# Altium project LASET_Prj.PrjPcb
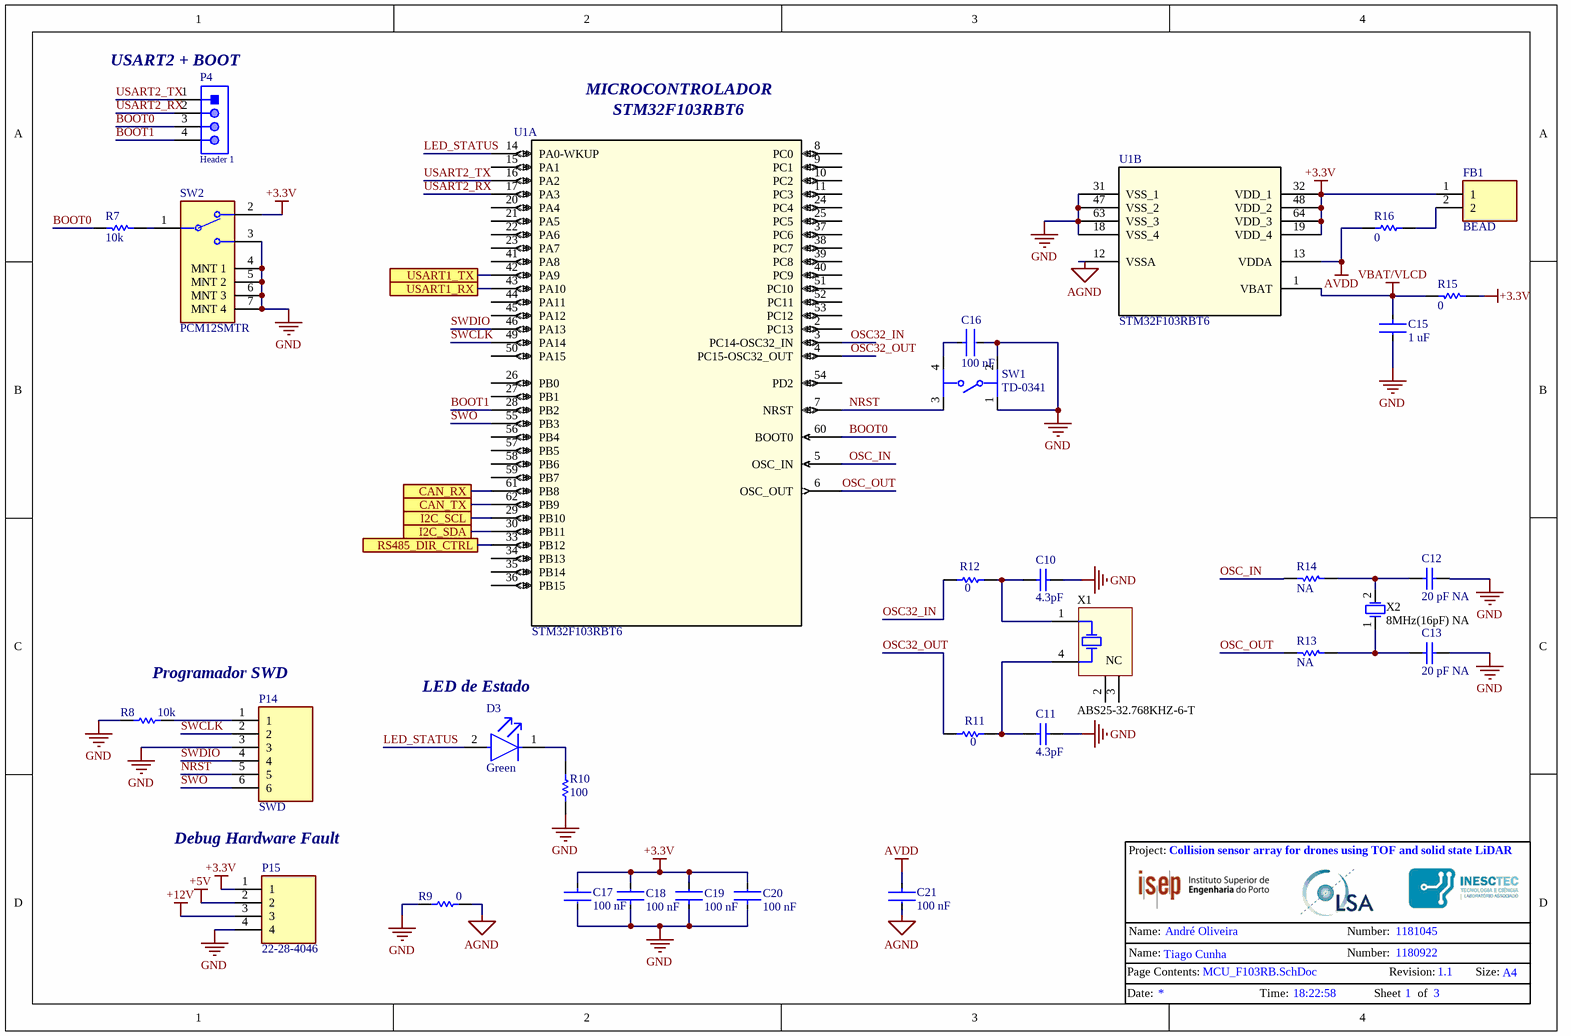
[diagram p0: MCU_F103RB.SchDoc]
Company: Laboratório de Sistemas Autónomos; Name1: André Oliveira; Name2: Tiago Cunha; Number1: 1181045; Number2: 1180922; Project: Collision sensor array for drones using TOF and solid state LiDAR; Size: A4; Time: 18:22:58; VersionRevision: 1.1
3 sheets, 89 parts. Net scope: flat (ports and power ports of the same name join across sheets).
Board file: PCB_Final.PcbDoc
Sheets:
  MCU_F103RB.SchDoc
  Source.SchDoc
  Communication Interfaces.SchDoc

## Sheet MCU_F103RB.SchDoc
size A4; SheetNumber: 1; SheetTotal: 3

### Parts
(Parts that share a designator on the sheet are numbered #1, #2 ... from top to bottom, then left to right.)
?#1  Title_Block  (value not drawn)  (graphical)
C10  4.3pF  [CAPC1608X90X35LL10T15]
C11  4.3pF  [CAPC1608X90X35LL10T15]
C12  20 pF NA  [CAPC1608X90X35NL15T15]
C13  20 pF NA  [CAPC1608X90X35NL15T15]
C15  1 uF  [FP-CC0603-DA-MFG]
C16  100 nF  [FP-CC0603-DA-MFG]
C17  100 nF  [FP-CC0603-DA-MFG]
C18  100 nF  [FP-CC0603-DA-MFG]
C19  100 nF  [FP-CC0603-DA-MFG]
C20  100 nF  [FP-CC0603-DA-MFG]
C21  100 nF  [FP-CC0603-DA-MFG]
D3  Green  [FP-6_541-5056_01-4-MFG]
FB1  BEAD  [BEADC1608X95N]
P4  Header 1  [61300411121]
P14  SWD  [HDRV6W30P0X127_1X6_762X210X430P]
P15  22-28-4046  [HDRV4W66P0X254_1X4_1016X249X838P]
R7  10k  [RESC1608X55X25ML10T15]
R8  10k  [RESC1608X55X25ML10T15]
R9  0  [RESC1608X55X25ML10T15]
R10  100  [RESC1608X55X30ML20T20]
R11  0  [RESC1608X55X25ML10T15]
R12  0  [RESC1608X55X25ML10T15]
R13  NA  [RESC1608X55X25ML10T15]
R14  NA  [RESC1608X55X25ML10T15]
R15  0  [RESC1608X55X25ML10T15]
R16  0  [RESC1608X55X25ML10T15]
SW1  TD-0341  [FP-1571563-9-MFG]
SW2  PCM12SMTR  [FP-PCM12SMTR-MFG]
U1  STM32F103RBT6  [LQFP64-10x10mm]  (parts A,B of 2)
X1  ABS25-32.768KHZ-6-T  [ABRA-ABS25-4_V]
X2  8MHz(16pF) NA  [FOX-FOXSLF160-20]

### Ports
CAN_RX, CAN_TX, I2C_SCL, I2C_SDA, RS485_DIR_CTRL, USART1_RX, USART1_TX

### Nets
+3.3V: C17.1 C18.2 C19.2 C20.2 FB1.1 P15.1 R15.1 SW2.2 U1.19(VDD_4) U1.32(VDD_1) U1.48(VDD_2) U1.64(VDD_3)
+5V: P15.2
+12V: P15.3
AGND: C21.2 R9.2 U1.12(VSSA)
AVDD: C21.1 R16.2 U1.13(VDDA)
GND: C10.2 C11.2 C12.1 C13.1 C15.2 C16.2 C17.2 C18.1 C19.1 C20.1 P14.3 P15.4 R8.1 R9.1 R10.1 SW1.1 SW1.2 SW2.3 SW2.4(MNT_1) SW2.5(MNT_2) SW2.6(MNT_3) SW2.7(MNT_4) U1.18(VSS_4) U1.31(VSS_1) U1.47(VSS_2) U1.63(VSS_3)
VBAT/VLCD: C15.1 R15.2 U1.1(VBAT)
BOOT0: P4.3 R7.2 U1.60(BOOT0)
BOOT1: P4.4 U1.28(PB2)
LED_STATUS: D3.2(A) U1.14(PA0-WKUP)
NRST: P14.5 SW1.3 U1.7(NRST)
OSC32_IN: R12.1 U1.3(PC14-OSC32_IN)
OSC32_OUT: R11.1 U1.4(PC15-OSC32_OUT)
OSC_IN: R14.2 U1.5(OSC_IN)
OSC_OUT: R13.2 U1.6(OSC_OUT)
SWCLK: P14.2 U1.49(PA14)
SWDIO: P14.4 U1.46(PA13)
SWO: P14.6 U1.55(PB3)
USART2_RX: P4.2 U1.17(PA3)
USART2_TX: P4.1 U1.16(PA2)
NetC10_1: C10.1 R12.2 X1.1(X1)
NetC11_1: C11.1 R11.2 X1.4(X2)
NetC12_2: C12.2 R14.1 X2.2
NetC13_2: C13.2 R13.1 X2.1
NetC16_1: C16.1 SW1.4
NetD3_1: D3.1(C) R10.2
NetFB1_2: FB1.2 R16.1
NetP6_2: U1.30(PB11) ; port I2C_SDA
NetP6_3: U1.29(PB10) ; port I2C_SCL
NetP14_1: P14.1 R8.2
NetR7_1: R7.1 SW2.1
NetR19_1: U1.33(PB12) ; port RS485_DIR_CTRL
NetR22_2: U1.42(PA9) ; port USART1_TX
NetR23_2: U1.43(PA10) ; port USART1_RX
NetU1_61: U1.61(PB8) ; port CAN_RX
NetU1_62: U1.62(PB9) ; port CAN_TX

Not connected (* = marked no-connect by the designer): U1 2(PC13) 8(PC0) 9(PC1) 10(PC2) 11(PC3) 15(PA1) 20(PA4) 21(PA5) 22(PA6) 23(PA7) 24(PC4) 25(PC5) 26(PB0) 27(PB1) 34(PB13) 35(PB14) 36(PB15) 37(PC6) 38(PC7) 39(PC8) 40(PC9) 41(PA8) 44(PA11) 45(PA12) 50(PA15) 51(PC10) 52(PC11) 53(PC12) 54(PD2) 56(PB4) 57(PB5) 58(PB6) 59(PB7); X1 2(NC) 3(NC)

### Notes on the sheet
- (near P4) USART2 + BOOT
- MICROCONTROLADOR
- (near U1) STM32F103RBT6
- Programador SWD
- (near D3) LED de Estado
- Debug Hardware Fault
- (in symbol Title_Block) Project:; Name:; Number:; Page Contents:; Revision:; Size:; Date:; Time:; Sheet; of

### Library data of the parts
C10 C11 = CMP-2006-02448-1: 0603; Part Number: GQM1885C2A4R3BB01D; Manufacturer: Murata
C12 C13 = CMP-2006-04264-1: Part Number: 06035A200JAT2A; Manufacturer: AVX Interconnect / Elco
C15 = CMP-1035-02737-2: CAP CER 1UF 16V X5R 0603; Manufacturer Part Number: CC0603KRX5R7BB105; Manufacturer: YAGEO; Material: Ceramic; Temperature Coefficient: 15%; Tolerance: 0.1; Digikey Description: CAP CER 1UF 16V X5R 0603; Category: Cap; Automotive: No; Octopart: https://octopart.com/cc0603krx5r7bb105-yageo-8376530; Voltage Rating: 16 V; Device Class L3: Ceramic Capacitors; Value: 1 uF; Temperature Characteristic: X5R; Voltage: 16 V; RoHS: TRUE; Lead Free: Yes; Temperature: -55°C to +125°C; Device Class L2: Capacitors; ComponentLink2URL: http://www.yageo.com/documents/recent/UPY-GPHC_X7R_6.3V-to-50V_18.pdf; Capacitance: 1 uF; Footprint Url: http://www.yageo.com/exep/pages/download/literatures/UPY-C_GEN_24.pdf; Height: 0.9mm; ComponentLink2Description: Datasheet; Temperature Range High: +125°C; Mouser Description: Multilayer Ceramic Capacitors MLCC - SMD/SMT 1.0uF 16V X5R 10%; Package: CC0603-DA; Device Class L1: Passive Components; Temperature Range Low: -55°C
C16-C21 = CMP-2100-03601-2: CAP CER 0.1UF 50V X7R 0603; Manufacturer: YAGEO; Manufacturer Part Number: CC0603KRX7R9BB104; Material: Ceramic; Temperature Coefficient: 15%; Tolerance: 0.1; Height: 0.9mm; Voltage: 50 V; ComponentLink2Description: Datasheet; Device Class L2: Capacitors; Temperature Range High: +125°C; Category: Cap; Capacitance: 100 nF; Footprint Url: http://www.yageo.com/exep/pages/download/literatures/UPY-C_GEN_24.pdf; ComponentLink2URL: http://www.yageo.com/documents/recent/UPY-GPHC_X7R_6.3V-to-50V_18.pdf; Package: CC0603-DA; Temperature: -55°C to +125°C; Voltage Rating: 50 V; Temperature Characteristic: X7R; Device Class L1: Passive Components; Temperature Range Low: -55°C; RoHS: TRUE; Automotive: No; Value: 100 nF; Device Class L3: Ceramic Capacitors; Octopart: https://octopart.com/cc0603krx7r9bb104-yageo-42244635; Mouser Description: Multilayer Ceramic Capacitor, CC Series, 0.1 - F, - 10%, X7R, 50 V, 0603 [1608 Metric]; Lead Free: Yes; Digikey Description: CAP CER 0.1UF 50V X7R 0603
D3 = CMP-02520-000009-1: LED GREEN 0603 SMD; Manufacturer Part Number: TLMP1100-GS08; Manufacturer: Vishay; Max Junction Temp: +120°C; Automotive Grade: Grade 3; Reverse Voltage: 6V; Led Orientation: Top View; Forward Voltage: 2.1V; Luminous Intensity: 15mcd; Forward Current: 20mA; Colour: Pure green; Peak Emmision Wavelength: 562nm; Wavelength: 561nm; Viewing Angle: 160°; Power Dissipation: 90mW; Digikey Description: LED GREEN 0603 SMD; Package: 6.541-5056.01-4; Ambient Temperature Range High: +100°C; Height: 0.65mm; Device Class L1: Optoelectronics; Device Class L2: LEDs; Mouser Description: Standard LEDs - SMD Pure Green; Temperature Range High: +120°C; RoHS: TRUE; Ambient Temperature Range Low: -40°C; Temperature: to +120°C; ComponentLink2URL: http://www.vishay.com/docs/83173/tlmb1100.pdf; Lead Free: Yes; Octopart: https://octopart.com/tlmp1100-gs08-vishay-55433993; Automotive: Yes; Device Class L3: unset; ComponentLink2Description: Datasheet; Category: Diode
FB1 = MMZ1608S601ATD25: Ferrite Bead; Manufacturer_Name: TDK; Datasheet Link: https://datasheet.datasheetarchive.com/originals/dk/DKDS-25/489214.pdf; Height: 0.95mm; Manufacturer_Part_Number: MMZ1608S601ATD25; Mouser Part Number: 810-MMZ1608S601ATD25; Mouser Price/Stock: https://www.mouser.co.uk/ProductDetail/TDK/MMZ1608S601ATD25?qs=pvNC7ksEVIeMnkuqWHgErw%3D%3D; Arrow Part Number: MMZ1608S601ATD25; Arrow Price/Stock: https://www.arrow.com/en/products/mmz1608s601atd25/tdk
P4 = CMP-1502-01064-1: THT Vertical Pin Header WR-PHD, Pitch 2.54 mm, Single Row, 4 pins; Manufacturer: Wurth Elektronik; Withstanding Voltage: 500VAC; Rated Current: 3A; Working Voltage: 250VAC; Pin Number: 4; Gender: Male; Contact Resistance: 20mOhm; Pitch: 2.54mm; Manufacturer URL: http://www.we-online.de; Operating Temperature: -40to105degC; Packaging: Bag; Mounting Technology: THT; Package Reference: 61300411121; Datasheet URL: https://katalog.we-online.de/em/datasheet/6130xx11121.pdf; Publisher: WurthElektronik; Part Number: 61300411121; Row Number: Single; Orientation: Vertical
P14 = M50-3530642: Connector; Manufacturer_Name: Harwin; Datasheet Link: https://cdn.harwin.com/pdfs/M50-353.pdf; Height: 4.3mm; Manufacturer_Part_Number: M50-3530642; Mouser Part Number: 855-M50-3530642; Mouser Price/Stock: https://www.mouser.co.uk/ProductDetail/Harwin/M50-3530642?qs=%252BdQmOuGyFcHPs2UJx%2F79Cg%3D%3D
P15 = 22-28-4046: Connector; Manufacturer_Name: Molex; Datasheet Link: https://componentsearchengine.com/Datasheets/1/22-28-4046.pdf; Height: 8.38mm; Manufacturer_Part_Number: 22-28-4046; Mouser Part Number: 538-22-28-4046; Mouser Price/Stock: https://www.mouser.co.uk/ProductDetail/Molex/22-28-4046?qs=GAPJcf4kvdtZsXSzVDpHFw%3D%3D
R7 R8 = CMP-2000-05022-1: Resistor, 10 kOhm, +/- 5%, 100 mW, -55 to 155 degC, 0603 (1608 Metric), RoHS, Tape and Reel; Manufacturer: Yageo; Resistance: 10kOhms; Voltage Rating: 50V; Temperature Coefficient: 100PPM/C; Power Rating: 100mW; Package Reference: 603; Series: RC; Case Code - mm: 1608; Packaging: Reel; Datasheet URL: http://www.farnell.com/datasheets/443971.pdf; Datasheet Version: Rev. 4, 04/2009; Operating Temperature Range: -55Cto+155C; Product: ThickFilmResistorsGeneralPurpose; Package Description: 2-Pin Surface Mount Device, Body 1.6 x 0.8 mm; Manufacturer URL: http://www.yageo.com/; Case Code - in: 0603; Tolerance: 5%; Termination Style: SMD/SMT
R9 R11-R16 = CMP-2100-03667-1: Chip Resistor, 0 Ohm, +/- 5%, 0.1 W, -55 to 155 degC, 0603 (1608 Metric), RoHS, Tape and Reel; Manufacturer: Yageo; Temperature Coefficient: 200ppm/degreesC; Voltage Rating: 50V; Power Rating: 100mW; Resistance: 0mOhm; Width: 0.8mm; Max Operating Temperature: 155degC; Tolerance: 5%; Package Reference: 0603; Height: 0.45mm; Depth: 0.8mm; Package Description: 2-Pin Surface Mount Device, Body 1.6 x 0.8 mm; Termination: SMD/SMT; Package Quantity: 5000; Case/Package: 0603; Case Code (Imperial): 0603; Radiation Hardening: No; Number of Pins: 2; Length: 1.6mm; Lead Free: LeadFree; Voltage Rating (DC): 50V; Military Standard: Not; Datasheet URL: http://www.yageo.com/NewPortal/yageodocoutput?fileName=/pdf/R-Chip/PYu-RC_Group_51_RoHS_L_5.pdf; Manufacturer URL: http://www.yageo.com/; Packaging: TapeandReel; Case Code (Metric): 1608; Min Operating Temperature: -55degC; Composition: ThickFilm; RoHSCompliant: true; Contact Plating: Tin; Datasheet Version: Rev. 5, 10/2016; REACH SVHC: NoSVHC
R10 = CMP-2000-00897-1: Manufacturer: Panasonic; Part Number: ERA3AEB122V
SW1 = CMP-03402-000005-1: SWITCH TACTILE SPST-NO 0.05A 24V; Manufacturer: TE Connectivity; Manufacturer Part Number: 1571563-9; Standoff Height: 0.05mm; Electromechanical Life: 100000Cycles; Contact Resistance: 100mΩ; Operating Force: 160gf; Contact Current Rating: 50mA; Automotive: No; Device Class L1: Electromechanical; Voltage Rating Dc: 24V; ComponentLink2Description: Datasheet; Mount: Surface Mount; RoHS: TRUE; Temperature: -35°C to +85°C; ComponentLink2URL: https://www.te.com/commerce/DocumentDelivery/DDEController?Action=showdoc&DocId=Customer+Drawing%7F2-1437565-7%7FV%7Fpdf%7FEnglish%7FENG_CD_2-1437565-7_V.pdf%7F1571563-9; Temperature Range Low: -35°C; Lead Free: Yes; Device Class L2: Switches; Package: SMT_SW_6MM0_6MM0; Octopart: https://octopart.com/1571563-9-te+connectivity-41253969; Throw Configuration: SPST-NO; Mouser Description: Tactile Switches SPST OFF(ON) RND SMT MINI PB TACT SWITCH; Temperature Range High: +85°C; Digikey Description: SWITCH TACTILE SPST-NO 0.05A 24V; Device Class L3: Pushbutton Switches; Category: Switch; Height: 9.75mm
SW2 = CMP-2000-06884-2: SWITCH SLIDE SPDT 300MA 6V; Actuator Material: Nylon; Switch Function: On-On; Insulation Resistance: 100mR; Actuator Type: Standard; Mechanical Life: 10000Cycles; Actuator Length: 1.5mm; Contact Resistance: 70mR; Min Operating Temperature: -20°C; Max Current Rating: 300mA; Max Voltage Rating (DC): 6V; Package Quantity: 1; Mount: Surface Mount; Packaging: Tape and Reel; Contact Plating: Silver; Depth: 5mm; REACH SVHC: No SVHC; Voltage Rating (DC): 6V; Voltage Rating (AC): 6V; Max Operating Temperature: 85°C; Length: 7.7mm; Termination: Gull Wing; Current Rating: 300mA; Contact Current Rating: 300mA; Orientation: Right Angle; Width: 6.7mm; Switch Travel: 1.5mm; Lead Free: Lead Free; Contact Material: Copper Alloy; Throw Configuration: SPDT
U1 = STM32F103RBT6: No Description Available; Mfr_Name: STMicroelectronics; Copyright: Copyright (C) 2021 Ultra Librarian. All rights reserved.; Manufacturer_Part_Number: STM32F103RBT6; RefDes: RefDes; Type: DEV
X1 = CMP-2000-05036-1: Low Frequency Crystal, 32.768 KHz, 6 pF, +/- 20 ppm, -40 to 85 degC, 4-Pin SMD, RoHS, Tape and Reel; Manufacturer: Abracon; Tolerance: 20PPM; ESR: 50kOhms; Case Width: 3.8mm; Case Height: 2.5mm; Case Length: 8mm; Load Capacitance: 6pF; Operating Temperature Range: -40Cto+85C; Package Reference: ABS25; Factory Pack Quantity: 3000; Package Description: 4-Pin Surface Mount Device, Body 8 x 3.8 mm, Pitch 5.5 mm; Frequency: 32.768kHz; Termination Style: SMD/SMT; Manufacturer URL: http://www.abracon.com/; Type: LowFrequencyCrystal; Dimensions: 3.8mmWx8mmLx2.5mmH; Product Category: Crystals; Series: ABS25; RoHS: Details; Package / Case: 8mmx3.8mm; Datasheet Version: Jun-17; Brand: ABRACON; Datasheet URL: https://datasheet.ciiva.com/854/abs25-854528.pdf; Packaging: Reel; Mounting Style: SMD/SMT
X2 = CMP-1749-00003-1: Resistance Weld Thru-Hole Crystal, 16 MHz, -20 to 70 degC, 2-Pin THD, RoHS, Bulk; Voltage Rating: 250 V; Tolerance: 1%; Resistance: 221 kohm; Case\Package: Axial; Power Rating: 250 mW; RoHSCompliant: true; Package Quantity: 200; Packaging: Bulk; Min Operating Temperature: -55 degC; DatasheetVersion: Mar-15; ComponentLink1URL: http://www.foxonline.com/; Max Operating Temperature: 155 degC; PackageReference: FOXSLF160-20; Mount: Through Hole; PackageDescription: 2-Pin Through Hole Device, Body 11.35 x 4.65 mm; ComponentLink1Description: Manufacturer URL; ComponentLink2URL: http://www.foxonline.com/pdfs/hc49slf.pdf; ComponentLink2Description: Datasheet; Length: 0.248 inch

## Sheet Source.SchDoc
size A4; SheetNumber: 2; SheetTotal: 3
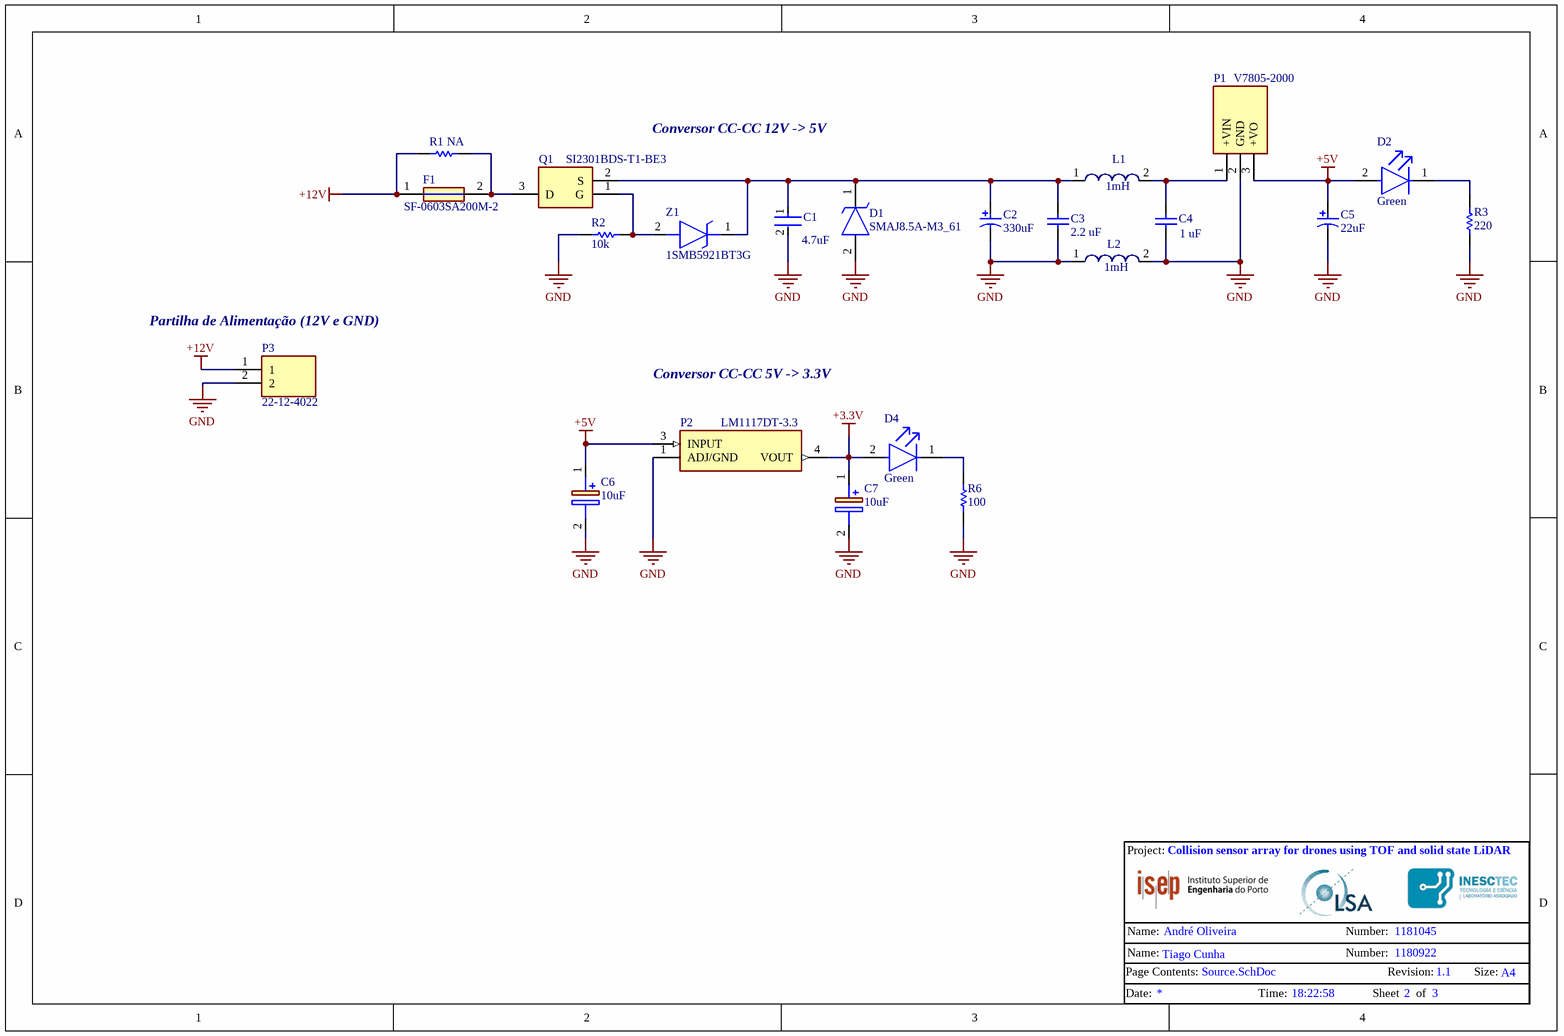
[diagram p1: Source.SchDoc]

### Parts
(Parts that share a designator on the sheet are numbered #1, #2 ... from top to bottom, then left to right.)
?#2  Title_Block  (value not drawn)  (graphical)
C1  4.7uF  [FP-C0603-CG-MFG]
C2  330uF  [NIC-CAPA2-8X10_V]
C3  2.2 uF  [CAPC2013X152X50ML20T25]
C4  1 uF  [CAPC3216X180X50ML20T25]
C5  22uF  [AVX-TAJ-B-2_M]
C6  10uF  [CAPPM3216X180N]
C7  10uF  [CAPPM3216X180N]
D1  SMAJ8.5A-M3_61  [DIOM5127X229N]
D2  Green  [FP-6_541-5056_01-4-MFG]
D4  Green  [FP-6_541-5056_01-4-MFG]
F1  SF-0603SA200M-2  [FUSC1608X95N]
L1  1mH  [1060]
L2  1mH  [1060]
P1  V7805-2000  [V78052000]
P2  LM1117DT-3.3  [TO228P991X238-3N]
P3  22-12-4022  [SHDRRA2W64P0X254_1X2_508X1170X580P]
Q1  SI2301BDS-T1-BE3  [SOT95P237X112-3N]
R1  NA  [RESC1608X55X30ML20T20]
R2  10k  [RESC1608X55X30ML20T20]
R3  220  [RESC1608X55X30ML20T20]
R6  100  [RESC1608X55X30ML20T20]
Z1  1SMB5921BT3G  [DIOM5436X247N]

### Nets
+3.3V: C7.1(+) D4.2(A) P2.4(VOUT)
+5V: C5.1 C6.1(+) D2.2(A) P1.3(+VO) P2.3(INPUT)
+12V: F1.1 P3.1 R1.2
GND: C1.2 C2.2 C3.1 C4.1 C5.2 C6.2(-) C7.2(-) D1.2(A) L2.1 L2.2 P1.2(GND) P2.1(ADJ/GND) P3.2 R2.2 R3.1 R6.1
NetC1_1: C1.1 C2.1 C3.2 D1.1(K) L1.1 Q1.2(S) Z1.1(K)
NetC4_2: C4.2 L1.2 P1.1(+VIN)
NetD2_1: D2.1(C) R3.2
NetD4_1: D4.1(C) R6.2
NetF1_2: F1.2 Q1.3(D) R1.1
NetQ1_1: Q1.1(G) R2.1 Z1.2(A)

### Notes on the sheet
- Conversor CC-CC 12V -> 5V
- (near P3) Partilha de Alimentação (12V e GND)
- Conversor CC-CC 5V -> 3.3V
- (in symbol Title_Block) Project:; Name:; Number:; Page Contents:; Revision:; Size:; Date:; Time:; Sheet; of

### Library data of the parts
C1 = CMP-2006-02256-2: CAP CER 4.7UF 6.3V X5R 0603; Manufacturer: Kemet; Manufacturer Part Number: C0603C475K9PACTU; Temperature Coefficient: 15%; Tolerance: 10%; Material: Ceramic; Device Class L3: Ceramic Capacitors; RoHS: TRUE; Value: 4.7uF; Lead Free: Yes; ComponentLink2Description: Datasheet; Mouser Description: Multilayer Ceramic Capacitors MLCC - SMD/SMT 6.3volts 4.7uF X5R 10%; Package: C0603-CG; Digikey Description: CAP CER 4.7UF 6.3V X5R 0603; ComponentLink2URL: https://content.kemet.com/datasheets/KEM_C1006_X5R_SMD.pdf; Category: Cap; Temperature Range Low: -55°C; Capacitance: 4.7uF; Temperature: -55°C to +85°C; Octopart: https://octopart.com/c0603c475k9pactu-kemet-104242; Ipc Land Pattern Name: CAPC16080X80; Voltage Rating: 6.3V; Temperature Range High: +85°C; Height: 0.9mm; Temperature Characteristic: X5R; Device Class L1: Passive Components; Automotive: No; Device Class L2: Capacitors
C2 = CMP-0687-00068-1: Aluminum Electrolytic Capacitor, UD Series, Low Impedance, 330 uF, 25 V, + / - 20%, -55 to 105 degC, Chip Type, 8 x 10 mm D x L, Pb-Free, Reel; PartNumber: UUD1E331MNL1GS; Manufacturer: Nichicon; Rated Voltage: 25 V; Tolerance Rated Capacitance: -20 to 20%; Packing: Dia382mm Reel; Impedance: 0.17 Ohm; Rated Ripple Current (at 100kHz): 450 mA; Endurance Time: 5000 h; ComponentLink3URL: http://products.nichicon.co.jp/en/pdf/XJA043/e-ud.pdf; PackageDescription: 2-Pin Surface Mount Device, Diameter 8 mm, Height 10 mm, Pitch 6.5 mm; ComponentLink1URL: http://www.nichicon.co.jp/; PackageReference: CAPAE-D8H10; ComponentLink1Description: Manufacturer URL; ComponentLink2Description: Datasheet; DatasheetVersion: 08/2012; RoHS: TRUE; Diameter: 8 mm; Mounting Technology: Surface Mount; ComponentLink2URL: http://products.nichicon.co.jp/en/pdf/XJA043/e-ud.pdf; ComponentLink3Description: Package Specification; Rated Capacitance: 330 uF; Length: 10 mm
C3 = CMP-2007-04514-1: Part Number: 08053C225KAT2A; Manufacturer: AVX Interconnect / Elco
C4 = CMP-2000-04991-1: Chip Capacitor, 1 uF, +/- 10%, 25 V, -55 to 125 degC, 1206 (3216 Metric), RoHS, Tape and Reel; Manufacturer: Kemet; Temperature Coefficient / Code: +/-15%; Capacitance: 1uF; Dielectric: X7R; Voltage Rating DC: 25V; Capacitance - nF: 1000nF; Class: Class1; Case Length: 3.2mm; Type: SMDMLCCX7R6.3-250VDCCommericalGrade; Case Width: 1.6mm; Product: GeneralTypeMLCCs; Datasheet URL: https://ciiva.com/datasheet-click-18194173?src=ciiva&sig=6daff8c4; Operating Temperature Range: -55Cto+125C; Series: C1206C; RoHS: Details; Product Category: MultilayerCeramicCapacitorsMLCC-SMD/SMT; Manufacturer URL: http://www.kemet.com/; Minimum Operating Temperature: -55C; Dimensions: 1.6mmWx3.2mmLx1.6mmH; Termination Style: SMD/SMT; Brand: Kemet; Packaging: Reel; Package / Case: 1206(3216metric); Case Code - mm: 3216; Datasheet Version: Jul-14; Factory Pack Quantity: 2000; Package Description: 2-Pin Surface Mount Device, Body 3.2 x 1.6 mm; Tolerance: 10%; Package Reference: 1206; Case Height: 1.6mm; Case Code - in: 1206; Maximum Operating Temperature: +125C; Voltage Rating: 25V
C5 = CMP-2100-03689-1: Standard Tantalum, 22 uF, +/- 10%, 16 V, -55 to 125 degC, 2-Pin SMD (1210), RoHS, Tape and Reel; Manufacturer: AVX; Leakage Current: 3.5uA; Dissipation Factor: 6%; Voltage Rating (DC): 16V; ESR (Equivalent Series Resistance): 2.3Ohm; Polarity: Polar; Package Quantity: 1; Tolerance: 10%; Number of Pins: 2; Manufacturer URL: http://www.avx.com/; Height - Seated (Max): 0.083inch; Case Code (Imperial): 1210; Package Reference: TAJ-B-2; Height: 1.9mm; Depth: 2.8mm; Packaging: TapeandReel; Termination: SMD/SMT; Case/Package: 1210; Lead Free: LeadFree; Min Operating Temperature: -55degC; Capacitance: 22uF; RoHSCompliant: True; Dielectric Material: Tantalum; Case Code (Metric): 3528; Width: 2.8mm; Datasheet URL: http://datasheets.avx.com/TAJ.pdf; Radiation Hardening: No; Package Description: 2-Pin Surface Mount Device, Body 3.5 x 2.85 mm; Length: 3.5mm; Voltage Rating: 16V; Datasheet Version: 42401.0; Max Operating Temperature: 125degC; REACH SVHC: NoSVHC; Voltage: 16V
C6 C7 = T491A106K020AT: Capacitor Polarised; Manufacturer_Name: Kemet; Datasheet Link: https://4donline.ihs.com/images/VipMasterIC/IC/KEME/KEME-S-A0006487387/KEME-S-A0006487387-1.pdf?hkey=52A5661711E402568146F3353EA87419; Height: 1.8mm; Manufacturer_Part_Number: T491A106K020AT; Mouser Part Number: 80-T491A106K020AT; Mouser Price/Stock: https://www.mouser.co.uk/ProductDetail/KEMET/T491A106K020AT?qs=TooEEMgOWu79qKWrUr4%2FRg%3D%3D; Arrow Part Number: T491A106K020AT; Arrow Price/Stock: https://www.arrow.com/en/products/t491a106k020at/kemet-corporation
D1 = SMAJ8.5A-M3_61: TVS Diode (Uni-directional); Manufacturer_Name: Vishay; Manufacturer_Part_Number: SMAJ8.5A-M3/61; Datasheet Link: http://www.alldatasheet.com/view.jsp?Searchword=SMAJ8.5A-M3/61; Height: 2.29mm
D2 D4 = CMP-02520-000009-1: as D3 on sheet MCU_F103RB; Digikey Description: LED GREEN 0603 SMD; Package: 6.541-5056.01-4; Ambient Temperature Range High: +100°C; Height: 0.65mm; Device Class L1: Optoelectronics; Device Class L2: LEDs; Mouser Description: Standard LEDs - SMD Pure Green; Temperature Range High: +120°C; RoHS: TRUE; Ambient Temperature Range Low: -40°C; Temperature: to +120°C; ComponentLink2URL: http://www.vishay.com/docs/83173/tlmb1100.pdf; Lead Free: Yes; Octopart: https://octopart.com/tlmp1100-gs08-vishay-55433993; Automotive: Yes; Device Class L3: unset; ComponentLink2Description: Datasheet; Category: Diode
F1 = SF-0603SA200M-2: Fuse; Manufacturer_Name: Bourns; Datasheet Link: https://www.bourns.com/docs/product-datasheets/sf-0603sa-m.pdf?sfvrsn=b5654bf6_7; Height: 0.95mm; Manufacturer_Part_Number: SF-0603SA200M-2; Mouser Part Number: 652-SF-0603SA200M-2; Mouser Price/Stock: https://www.mouser.co.uk/ProductDetail/Bourns/SF-0603SA200M-2?qs=ljCeji4nMDnUko368dFg%2Fg%3D%3D
L1 L2 = CMP-1387-00004-1: SMD Power Inductor WE-PD HV, L=1000 µH; Manufacturer: Wuerth Elektronik; PartNumber: 7687714102; Inductance: 1000 ÂµH; ComponentLink1Description: Manufacturer URL; ComponentLink2Description: Datasheet; PackageReference: 1060; ComponentLink2URL: http://www.we-online.de/katalog/media/pdf/7687714102.pdf; ComponentLink1URL: http://www.we-online.com
P1 = V7805-2000: Power Supply; Manufacturer_Name: CUI Inc.; Datasheet Link: https://componentsearchengine.com/Datasheets/1/V7805-2000.pdf; Height: 17.5mm; Manufacturer_Part_Number: V7805-2000; Mouser Part Number: 490-V7805-2000; Mouser Price/Stock: https://www.mouser.co.uk/ProductDetail/CUI-Inc/V7805-2000?qs=WyjlAZoYn5278Y2RvahTNg%3D%3D; Arrow Part Number: V7805-2000; Arrow Price/Stock: https://www.arrow.com/en/products/v7805-2000/cui-inc?region=nac
P2 = LM1117DT-3.3_NOPB: Integrated Circuit; Manufacturer_Name: Texas Instruments; Manufacturer_Part_Number: LM1117DT-3.3/NOPB; Datasheet Link: https://datasheet.datasheetarchive.com/originals/distributors/Datasheets-SFU2/DSASFU100036103.pdf; Height: 2.38mm; Mouser Part Number: 926-LM1117DT-3.3NOPB; Mouser Price/Stock: https://www.mouser.co.uk/ProductDetail/Texas-Instruments/LM1117DT-33-NOPB?qs=X1J7HmVL2ZHOT670myqy2w%3D%3D; Arrow Part Number: LM1117DT-3.3/NOPB; Arrow Price/Stock: https://www.arrow.com/en/products/lm1117dt-3.3nopb/texas-instruments
P3 = 22-12-4022: Connector; Manufacturer_Name: Molex; Datasheet Link: https://www.molex.com/pdm_docs/sd/022124022_sd.pdf; Height: 5.8mm; Manufacturer_Part_Number: 22-12-4022; Mouser Part Number: 538-22-12-4022; Mouser Price/Stock: https://www.mouser.co.uk/ProductDetail/Molex/22-12-4022?qs=SdQWveS8jHPGKP%2Fe4QVy2w%3D%3D
Q1 = SI2301BDS-T1-BE3: Integrated Circuit; Manufacturer_Name: Vishay; Datasheet Link: https://www.arrow.com/en/products/si2301bds-t1-be3/vishay?region=nac; Height: 1.12mm; Manufacturer_Part_Number: SI2301BDS-T1-BE3; Mouser Part Number: 78-SI2301BDS-T1-BE3; Mouser Price/Stock: https://www.mouser.co.uk/ProductDetail/Vishay-Siliconix/SI2301BDS-T1-BE3?qs=CiayqK2gdcLKGqyOqDFpxQ%3D%3D; Arrow Part Number: SI2301BDS-T1-BE3; Arrow Price/Stock: https://www.arrow.com/en/products/si2301bds-t1-be3/vishay?region=nac
R1-R3 R6 = CMP-2000-00897-1: as R10 on sheet MCU_F103RB
Z1 = 1SMB5921BT3G: Zener Diode; Manufacturer_Name: ON Semiconductor; Datasheet Link: http://www.onsemi.com/pub/Collateral/1SMB5913BT3-D.PDF; Height: 2.47mm; Manufacturer_Part_Number: 1SMB5921BT3G; Mouser Part Number: 863-1SMB5921BT3G; Mouser Price/Stock: https://www.mouser.co.uk/ProductDetail/ON-Semiconductor/1SMB5921BT3G?qs=vLkC5FC1VN%2FJmQCOkKzbLQ%3D%3D; Arrow Part Number: 1SMB5921BT3G; Arrow Price/Stock: https://www.arrow.com/en/products/1smb5921bt3g/on-semiconductor

## Sheet Communication Interfaces.SchDoc
size A4; SheetNumber: 3; SheetTotal: 3
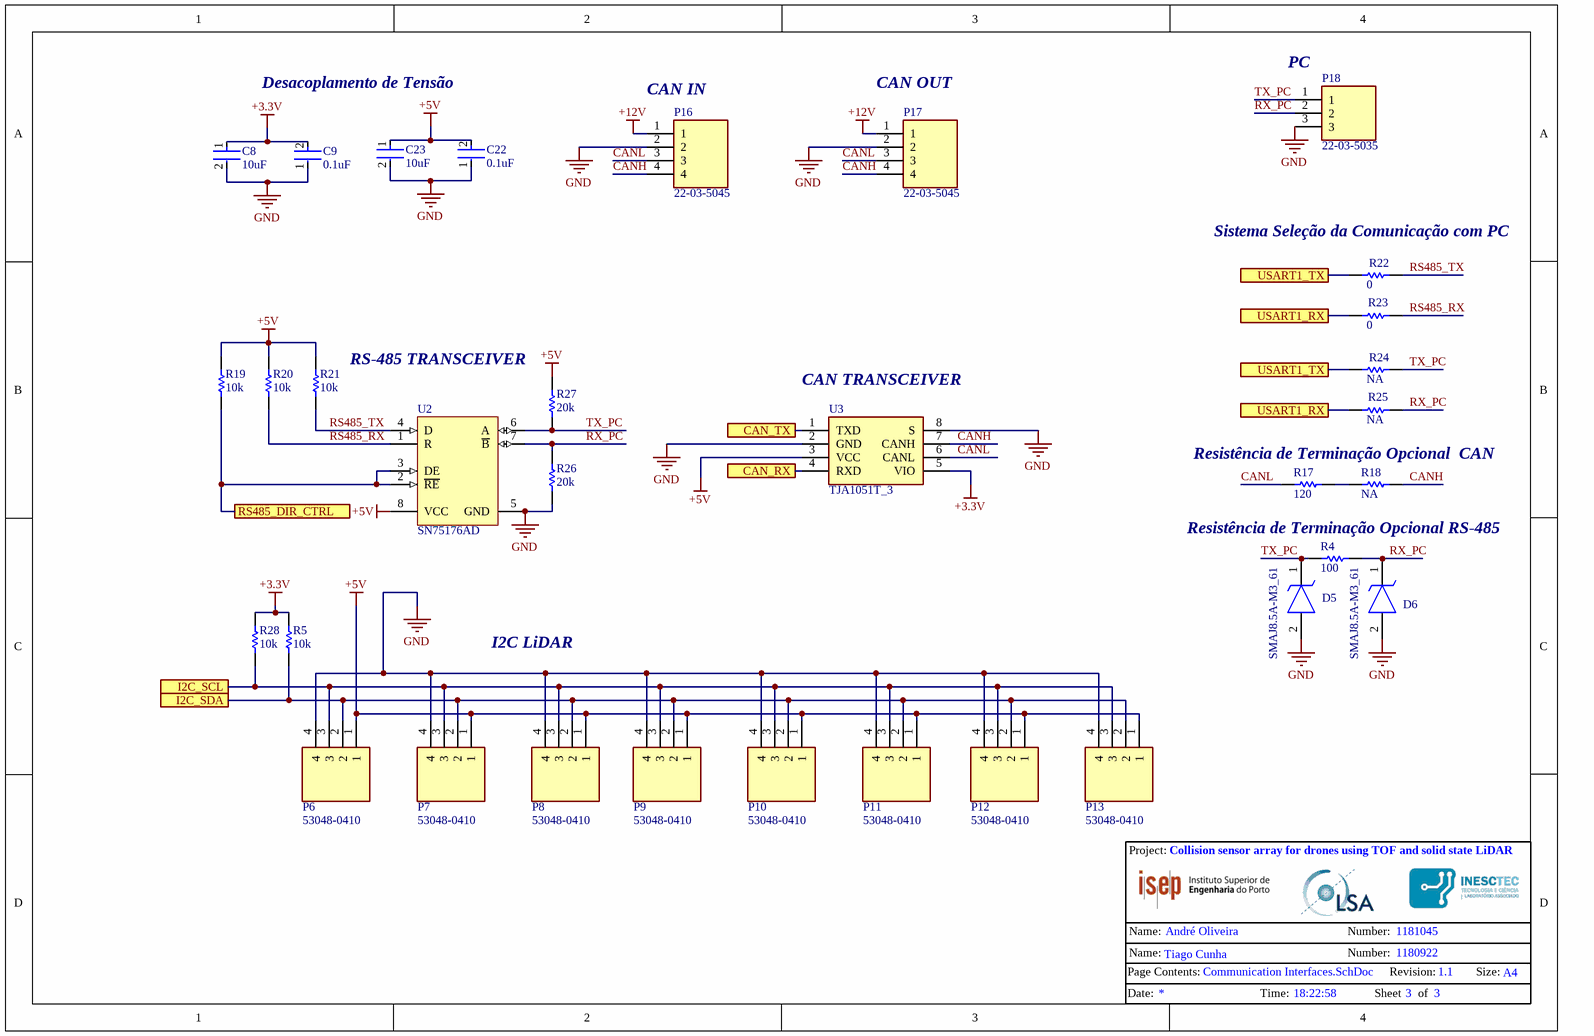
[diagram p2: Communication Interfaces.SchDoc]

### Parts
(Parts that share a designator on the sheet are numbered #1, #2 ... from top to bottom, then left to right.)
?#3  Title_Block  (value not drawn)  (graphical)
C8  10uF  [FP-C3216-160-0_2-IPC_C]
C9  0.1uF  [FP-GRM15-MFG]
C22  0.1uF  [FP-GRM15-MFG]
C23  10uF  [FP-C3216-160-0_2-IPC_C]
D5  SMAJ8.5A-M3_61  [DIOM5127X229N]
D6  SMAJ8.5A-M3_61  [DIOM5127X229N]
P6  53048-0410  [530480410]
P7  53048-0410  [530480410]
P8  53048-0410  [530480410]
P9  53048-0410  [530480410]
P10  53048-0410  [530480410]
P11  53048-0410  [530480410]
P12  53048-0410  [530480410]
P13  53048-0410  [530480410]
P16  22-03-5045  [SHDR4W70P0X250_1X4_1240X490X610P]
P17  22-03-5045  [SHDR4W70P0X250_1X4_1240X490X610P]
P18  22-03-5035  [SHDR3W60P0X250_1X3_990X490X590P]
R4  100  [RESC1608X55X30ML20T20]
R5  10k  [RESC1608X55X30ML20T20]
R17  120  [RESC1608X55X30ML20T20]
R18  NA  [RESC1608X55X30ML20T20]
R19  10k  [RESC1608X55X30ML20T20]
R20  10k  [RESC1608X55X30ML20T20]
R21  10k  [RESC1608X55X30ML20T20]
R22  0  [RESC1608X55X30ML20T20]
R23  0  [RESC1608X55X30ML20T20]
R24  NA  [RESC1608X55X30ML20T20]
R25  NA  [RESC1608X55X30ML20T20]
R26  20k  [RESC1608X55X30ML20T20]
R27  20k  [RESC1608X55X30ML20T20]
R28  10k  [RESC1608X55X30ML20T20]
U2  SN75176AD  [D0008A_M]
U3  TJA1051T_3  [SOIC127P600X175-8N]

### Ports
CAN_RX, CAN_TX, I2C_SCL, I2C_SDA, RS485_DIR_CTRL, USART1_RX, USART1_TX

### Nets
+3.3V: C8.1 C9.2 R5.2 R28.2 U3.5(VIO)
+5V: C22.2 C23.1 P6.1 P7.1 P8.1 P9.1 P10.1 P11.1 P12.1 P13.1 R19.2 R20.2 R21.2 R27.1 U2.8(VCC) U3.3(VCC)
+12V: P16.1 P17.1
GND: C8.2 C9.1 C22.1 C23.2 D5.2(A) D6.2(A) P6.4 P7.4 P8.4 P9.4 P10.4 P11.4 P12.4 P13.4 P16.2 P17.2 P18.3 R26.2 U2.5(GND) U3.2(GND) U3.8(S)
CANH: P16.4 P17.4 R18.1 U3.7(CANH)
CANL: P16.3 P17.3 R17.2 U3.6(CANL)
RS485_RX: R20.1 R23.1 U2.1(R)
RS485_TX: R21.1 R22.1 U2.4(D)
RX_PC: D6.1(K) P18.2 R4.1 R25.1 R26.1 U2.7(~{B})
TX_PC: D5.1(K) P18.1 R4.2 R24.1 R27.2 U2.6(A)
NetP6_2: P6.2 P7.2 P8.2 P9.2 P10.2 P11.2 P12.2 P13.2 R5.1 ; port I2C_SDA
NetP6_3: P6.3 P7.3 P8.3 P9.3 P10.3 P11.3 P12.3 P13.3 R28.1 ; port I2C_SCL
NetR17_1: R17.1 R18.2
NetR19_1: R19.1 U2.2(~{RE}) U2.3(DE) ; port RS485_DIR_CTRL
NetR22_2: R22.2 R24.2 ; port USART1_TX
NetR23_2: R23.2 R25.2 ; port USART1_RX
NetU1_61: U3.4(RXD) ; port CAN_RX
NetU1_62: U3.1(TXD) ; port CAN_TX

### Notes on the sheet
- Desacoplamento de Tensão
- (near P16) CAN IN
- (near P17) CAN OUT
- (near P18) PC
- (near R22) Sistema Seleção da Comunicação com PC
- RS-485 TRANSCEIVER
- (near U3) CAN TRANSCEIVER
- Resistência de Terminação Opcional  CAN
- (near R4) Resistência de Terminação Opcional RS-485
- I2C LiDAR
- (in symbol Title_Block) Project:; Name:; Number:; Page Contents:; Revision:; Size:; Date:; Time:; Sheet; of

### Library data of the parts
C8 C23 = CMP-08246-003443-1: Multilayer Ceramic Capacitors 10uF ±10% 16V X5R SMD 1206; Packaging: Tape and Reel; Thickness: 0.071inch; REACH SVHC: No SVHC; Lead Free: Lead Free; Voltage: 16V; Case Code (Imperial): 1206; RoHS Compliant: Yes; Dielectric Material: Ceramic; Termination: SMD/SMT; Resistor Type: Ceramic; Dielectric: X5R; Width: 0.063inch; Construction: Flat; Length: 3.2mm; Voltage Rating (DC): 16V; Case/Package: 1206; Series: C; Package Quantity: 1; Weight: 0.000571oz; Height: 1.6mm; Voltage Rating: 16V; Tolerance: 10%; Case Code (Metric): 3216; Max Operating Temperature: 85°C; Mount: Surface Mount; Min Operating Temperature: -55°C; Depth: 1.6mm; Radiation Hardening: No; Capacitance: 10uF
C9 C22 = CMP-2100-03641-2: CAP CER 0.1UF 16V X7R 0402; Manufacturer Part Number: GRM155R71C104KA88D; Manufacturer: Murata; Standoff Height: 0mm; Tolerance: 10%; Voltage Rating: 16Vdc; Material: Ceramic; Capacitance: 0.10μF; Value: 0.10μF; RoHS: TRUE; Temperature Characteristic: X7R; Octopart: https://octopart.com/grm155r71c104ka88d-murata-196880; Digikey Description: CAP CER 0.1UF 16V X7R 0402; Device Class L3: Ceramic Capacitors; Height: 0.55mm; ComponentLink2Description: Datasheet; Temperature Range Low: -55°C; Ipc Land Pattern Name: CAPC10050X219; ComponentLink2URL: https://search.murata.co.jp/Ceramy/image/img/A01X/G101/ENG/GRM155R71H471KA01-01A.pdf; Device Class L1: Passive Components; Lead Free: yes; Category: Cap; Package: GRM15; Temperature: -55°C to +125°C; Device Class L2: Capacitors; Temperature Range High: +125°C; Mouser Description: 0402 0.1 uF 16V ±10 % Tolerance X7R SMT Multilayer Ceramic Capacitor
D5 D6 = SMAJ8.5A-M3_61: as D1 on sheet Source; Datasheet Link: http://www.alldatasheet.com/view.jsp?Searchword=SMAJ8.5A-M3/61; Height: 2.29mm
P6-P13 = 53048-0410: Connector; Manufacturer_Name: Molex; Datasheet Link: https://www.molex.com/pdm_docs/sd/530480410_sd.pdf; Height: 3.7mm; Manufacturer_Part_Number: 53048-0410; Mouser Part Number: 538-53048-0410; Mouser Price/Stock: https://www.mouser.co.uk/ProductDetail/Molex/53048-0410?qs=359VwiUTsp2msj5Tobchuw%3D%3D
P16 P17 = 22-03-5045: Connector; Manufacturer_Name: Molex; Datasheet Link: https://componentsearchengine.com/Datasheets/2/22-03-5045.pdf; Height: 6.1mm; Manufacturer_Part_Number: 22-03-5045; Mouser Part Number: 538-22-03-5045; Mouser Price/Stock: https://www.mouser.co.uk/ProductDetail/Molex/22-03-5045?qs=ZDXmSm13592ymm0ujoo9aQ%3D%3D
P18 = 22-03-5035: Connector; Manufacturer_Name: Molex; Datasheet Link: http://www.molex.com/pdm_docs/sd/022035035_sd.pdf; Height: 5.9mm; Manufacturer_Part_Number: 22-03-5035; Mouser Part Number: 538-22-03-5035; Mouser Price/Stock: https://www.mouser.co.uk/ProductDetail/Molex/22-03-5035?qs=VKrXD49J9Ep%252Bv2WwbOoiPA%3D%3D
R4 R5 R17-R28 = CMP-2000-00897-1: as R10 on sheet MCU_F103RB
U2 = CMP-0310-00139-2: Differential Bus Transceiver, 1 TX / 1 RX, 5V, 0 to 70 degC, 8-Pin SOIC (D), Green (RoHS & no Sb/Br); Manufacturer: Texas Instruments; Rating: Catalog; ESD(kV): 2; Supply Voltage(s)(V): 5; Receivers Per Package: 1; ICC(Max)(mA): 50; SubFamily: RS-422; DatasheetVersion: SLLS100A; Footprint: SN75176; PackageDescription: 8-Pin Plastic Small Outline Integrated Circuit, 4.9 x 3.9 mm, Pitch 1.27 mm Pitch; ComponentLink2Description: Package Specification; # of TX/RX: 1 TX / 1 RX; ComponentLink2URL: http://www.ti.com/lit/ml/msoi002j/msoi002j.pdf; PartNumber: SN75176AD; Drivers Per Package: 1; PackageVersion: revM, Jun-2011; Eco-Plan: Green (RoHS & no Sb/Br); Isolated: No; Mounting Technology: Surface Mount; PackageReference: D0008A; Code_JEDEC: MS-012AA; ComponentLink1URL: http://www.ti.com/general/docs/lit/getliterature.tsp?genericPartNumber=SN75176A&fileType=pdf; ComponentLink1Description: Datasheet
U3 = TJA1051T_3_CM,118: Integrated Circuit; Manufacturer_Name: NXP; Manufacturer_Part_Number: TJA1051T/3/CM,118; Datasheet Link: http://www.nxp.com/docs/en/data-sheet/TJA1051.pdf; Height: 1.75mm; Mouser Part Number: 771-TJA1051T/3CM118; Mouser Price/Stock: https://www.mouser.co.uk/ProductDetail/NXP-Semiconductors/TJA1051T-3-CM118?qs=5XOdhvmYM0NUkmo%252BpXvJfw%3D%3D; Arrow Part Number: TJA1051T/3/CM,118; Arrow Price/Stock: https://www.arrow.com/en/products/tja1051t3cm118/nxp-semiconductors?region=nac

## Nets that join several sheets
+3.3V: MCU_F103RB (12 pins), Source (C7.1 D4.2 P2.4), Communication Interfaces (5 pins)
+5V: MCU_F103RB (P15.2), Source (5 pins), Communication Interfaces (16 pins)
+12V: MCU_F103RB (P15.3), Source (F1.1 P3.1 R1.2), Communication Interfaces (P16.1 P17.1)
GND: MCU_F103RB (26 pins), Source (16 pins), Communication Interfaces (21 pins)
NetP6_2: MCU_F103RB (U1.30), Communication Interfaces (9 pins)
NetP6_3: MCU_F103RB (U1.29), Communication Interfaces (9 pins)
NetR19_1: MCU_F103RB (U1.33), Communication Interfaces (R19.1 U2.2 U2.3)
NetR22_2: MCU_F103RB (U1.42), Communication Interfaces (R22.2 R24.2)
NetR23_2: MCU_F103RB (U1.43), Communication Interfaces (R23.2 R25.2)
NetU1_61: MCU_F103RB (U1.61), Communication Interfaces (U3.4)
NetU1_62: MCU_F103RB (U1.62), Communication Interfaces (U3.1)